# Altium schematic sheet Mictor38AdapterSchematic.SchDoc
size A; SheetNumber: 1; SheetTotal: 1
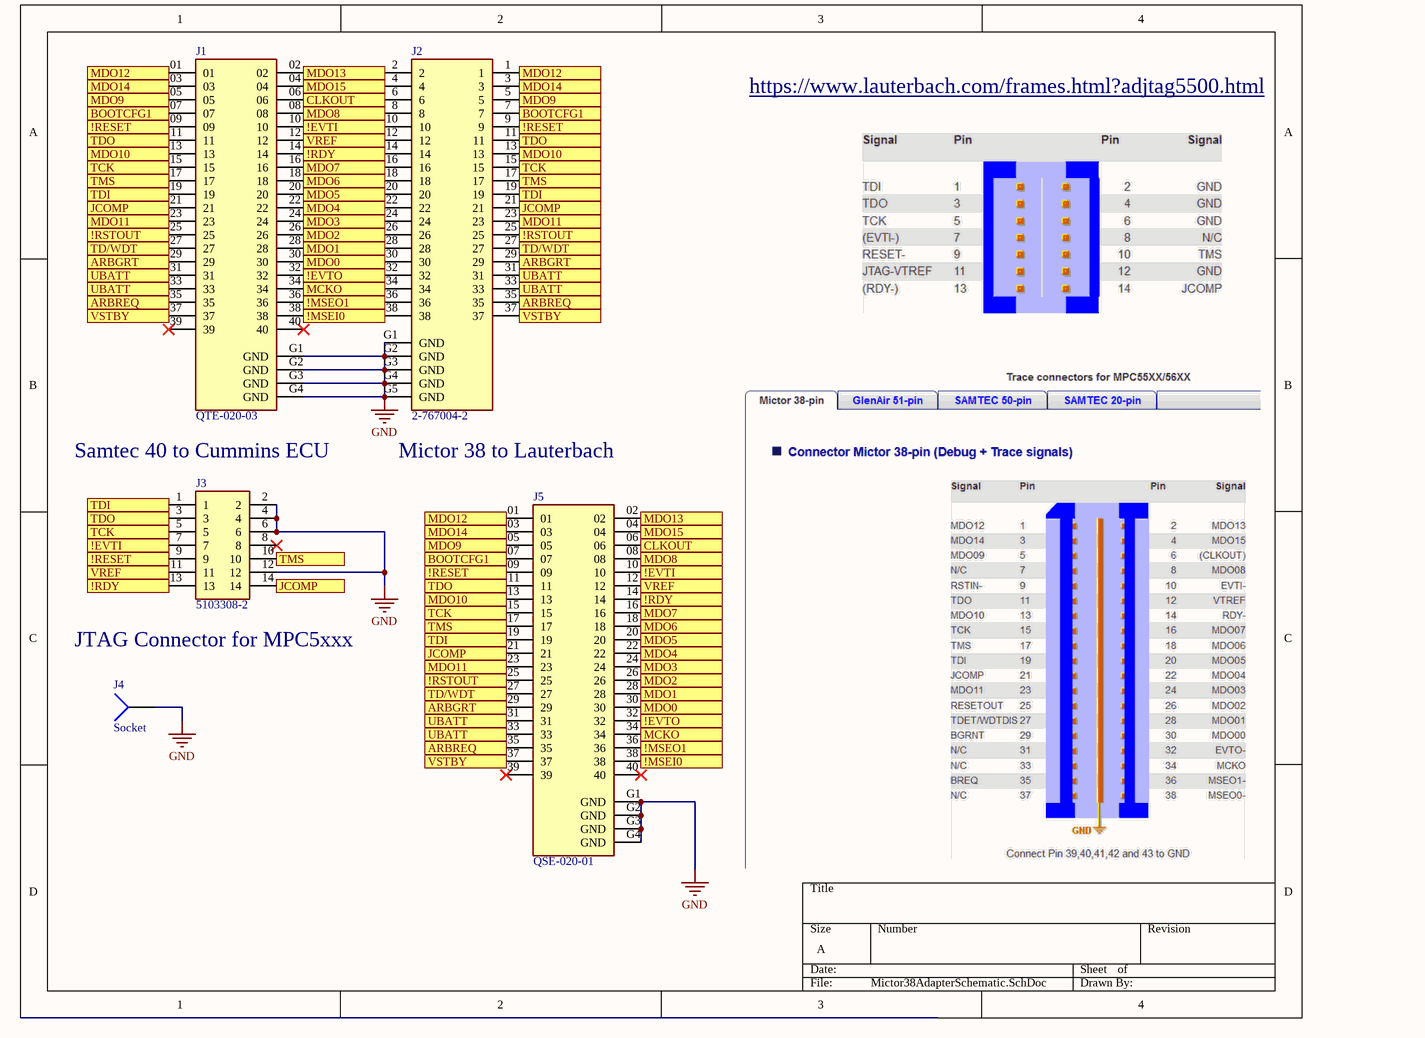
[diagram p0: Mictor38AdapterSchematic.SchDoc]

## Parts
J1  QTE-020-03  [SAMTEC_QTE-020-03-X-D-A-K-XX]
J2  2-767004-2  [TE_2-767004-2]
J3  5103308-2  [TE_5103308-2]
J4  Socket  [PIN1]
J5  QSE-020-01  [SAMTEC_QSE-020-01-XXX-D-A-L]

## Ports
!EVTI, !EVTO, !MSEI0, !MSEO1, !RDY, !RESET, !RSTOUT, ARBGRT, ARBREQ, BOOTCFG1, CLKOUT, JCOMP, MCKO, MDO0, MDO1, MDO2, MDO3, MDO4, MDO5, MDO6, MDO7, MDO8, MDO9, MDO10, MDO11, MDO12, MDO13, MDO14, MDO15, TCK, TD/WDT, TDI, TDO, TMS, UBATT , VREF, VSTBY

## Nets
GND: J1.G1(GND) J1.G2(GND) J1.G3(GND) J1.G4(GND) J2.G1(GND) J2.G2(GND) J2.G3(GND) J2.G4(GND) J2.G5(GND) J3.2 J3.4 J3.6 J3.12 J4.1 J5.G1(GND) J5.G2(GND) J5.G3(GND) J5.G4(GND)
!EVTI: J1.10 J2.10 J3.7 J5.10 ; port !EVTI
!EVTO: J1.32 J2.32 J5.32 ; port !EVTO
!MSEI0: J1.38 J2.38 J5.38 ; port !MSEI0
!MSEO1: J1.36 J2.36 J5.36 ; port !MSEO1
!RDY: J1.14 J2.14 J3.13 J5.14 ; port !RDY
!RESET: J1.09 J2.9 J3.9 J5.09 ; port !RESET
!RSTOUT: J1.25 J2.25 J5.25 ; port !RSTOUT
ARBGRT: J1.29 J2.29 J5.29 ; port ARBGRT
ARBREQ: J1.35 J2.35 J5.35 ; port ARBREQ
BOOTCFG1: J1.07 J2.7 J5.07 ; port BOOTCFG1
CLKOUT: J1.06 J2.6 J5.06 ; port CLKOUT
JCOMP: J1.21 J2.21 J3.14 J5.21 ; port JCOMP
MCKO: J1.34 J2.34 J5.34 ; port MCKO
MDO0: J1.30 J2.30 J5.30 ; port MDO0
MDO1: J1.28 J2.28 J5.28 ; port MDO1
MDO2: J1.26 J2.26 J5.26 ; port MDO2
MDO3: J1.24 J2.24 J5.24 ; port MDO3
MDO4: J1.22 J2.22 J5.22 ; port MDO4
MDO5: J1.20 J2.20 J5.20 ; port MDO5
MDO6: J1.18 J2.18 J5.18 ; port MDO6
MDO7: J1.16 J2.16 J5.16 ; port MDO7
MDO8: J1.08 J2.8 J5.08 ; port MDO8
MDO9: J1.05 J2.5 J5.05 ; port MDO9
MDO10: J1.13 J2.13 J5.13 ; port MDO10
MDO11: J1.23 J2.23 J5.23 ; port MDO11
MDO12: J1.01 J2.1 J5.01 ; port MDO12
MDO13: J1.02 J2.2 J5.02 ; port MDO13
MDO14: J1.03 J2.3 J5.03 ; port MDO14
MDO15: J1.04 J2.4 J5.04 ; port MDO15
TCK: J1.15 J2.15 J3.5 J5.15 ; port TCK
TD/WDT: J1.27 J2.27 J5.27 ; port TD/WDT
TDI: J1.19 J2.19 J3.1 J5.19 ; port TDI
TDO: J1.11 J2.11 J3.3 J5.11 ; port TDO
TMS: J1.17 J2.17 J3.10 J5.17 ; port TMS
UBATT : J1.31 J1.33 J2.31 J2.33 J5.31 J5.33 ; port UBATT 
VREF: J1.12 J2.12 J3.11 J5.12 ; port VREF
VSTBY: J1.37 J2.37 J5.37 ; port VSTBY

Not connected (* = marked no-connect by the designer): J1 39* 40*; J3 8*; J5 39* 40*

## Notes on the sheet
- https://www.lauterbach.com/frames.html?adjtag5500.html
- Samtec 40 to Cummins ECU
- Mictor 38 to Lauterbach
- JTAG Connector for MPC5xxx

## Library data of the parts
J1 = QTE-020-03-X-D-A-K-XX: 40 Position Connector Header, Outer Shroud Contacts Surface Mount Gold; MP: QTE-020-03-F-D-A-K-TR; MF: Samtec; SnapEDA_Link: https://www.snapeda.com/parts/QTE-020-03-F-D-A-K-TR/Samtec/view-part/3359767/?ref=snap; Package: None; Purchase-URL: https://pricing.snapeda.com/search/part/QTE-020-03-F-D-A-K-TR/?ref=eda; Check_prices: https://www.snapeda.com/parts/QTE-020-03-F-D-A-K-TR/Samtec/view-part/3359767/?ref=eda; Price: None; Value: *; Availability: In Stock
J2 = 2-767004-2: Conn High Speed Fine Pitch Connector RCP 38 POS 2.54mm/0.64mm Solder ST Thru-Hole/SMD Automotive Tube; MF: TE Connectivity; Centerline_Pitch: .64; Number_of_Positions: 38; EU_RoHS_Compliance: Not Compliant; Product_Type: Connector; SnapEDA_Link: https://www.snapeda.com/parts/2-767004-2/TE%20Connectivity%20AMP%20Connectors/view-part/511554/?ref=snap; Digi-Key_Part_Number: A29126-ND; MP: 2-767004-2; TE_purchase_URL: https://www.te.com/usa-en/product-2-767004-2.html?te_bu=Cor&te_type=disp&te_campaign=seda_glo_cor-seda-global-disp-prtnr-fy19-seda-model-bom-cta_sma-317_1&elqCampaignId=32493; Package: None; Digi-Key_Purchase_URL: https://www.digikey.com/product-detail/en/te-connectivity-amp-connectors/2-767004-2/A29126-ND/299338?utm_source=snapeda&utm_medium=aggregator&utm_campaign=symbol; Value: *
J3 = 5103308-2: Header;  Pin;  Vertical;  Copper Alloy;  Thermoplastic;  14;  0.100 x 0.100 in.;  1 A; MF: TE Connectivity; Package: None; Value: *; Availability: Unavailable; MP: 5103308-2; SnapEDA_Link: https://www.snapeda.com/parts/5103308-2/TE%20Connectivity%20AMP%20Connectors/view-part/427979/?ref=snap; Price: None
J5 = QSE-020-01-XXX-D-A-L: 40 Position Connector Receptacle, Center Strip Contacts Surface Mount Gold; MF: Samtec; MP: QSE-020-01-F-D-A-L; Price: None; Check_prices: https://www.snapeda.com/parts/QSE-020-01-F-D-A-L/Samtec/view-part/3269161/?ref=eda; Purchase-URL: https://pricing.snapeda.com/search/part/QSE-020-01-F-D-A-L/?ref=eda; SnapEDA_Link: https://www.snapeda.com/parts/QSE-020-01-F-D-A-L/Samtec/view-part/3269161/?ref=snap; Package: None; Availability: Bad; Value: *
J4 = Socket: LatestRevisionDate: 17-Jul-2002; LatestRevisionNote: Re-released for DXP Platform.; Publisher: Altium Limited